# EAGLE design SparkFun_6DoF_LSM6DSO (EAGLE 9.6.2)
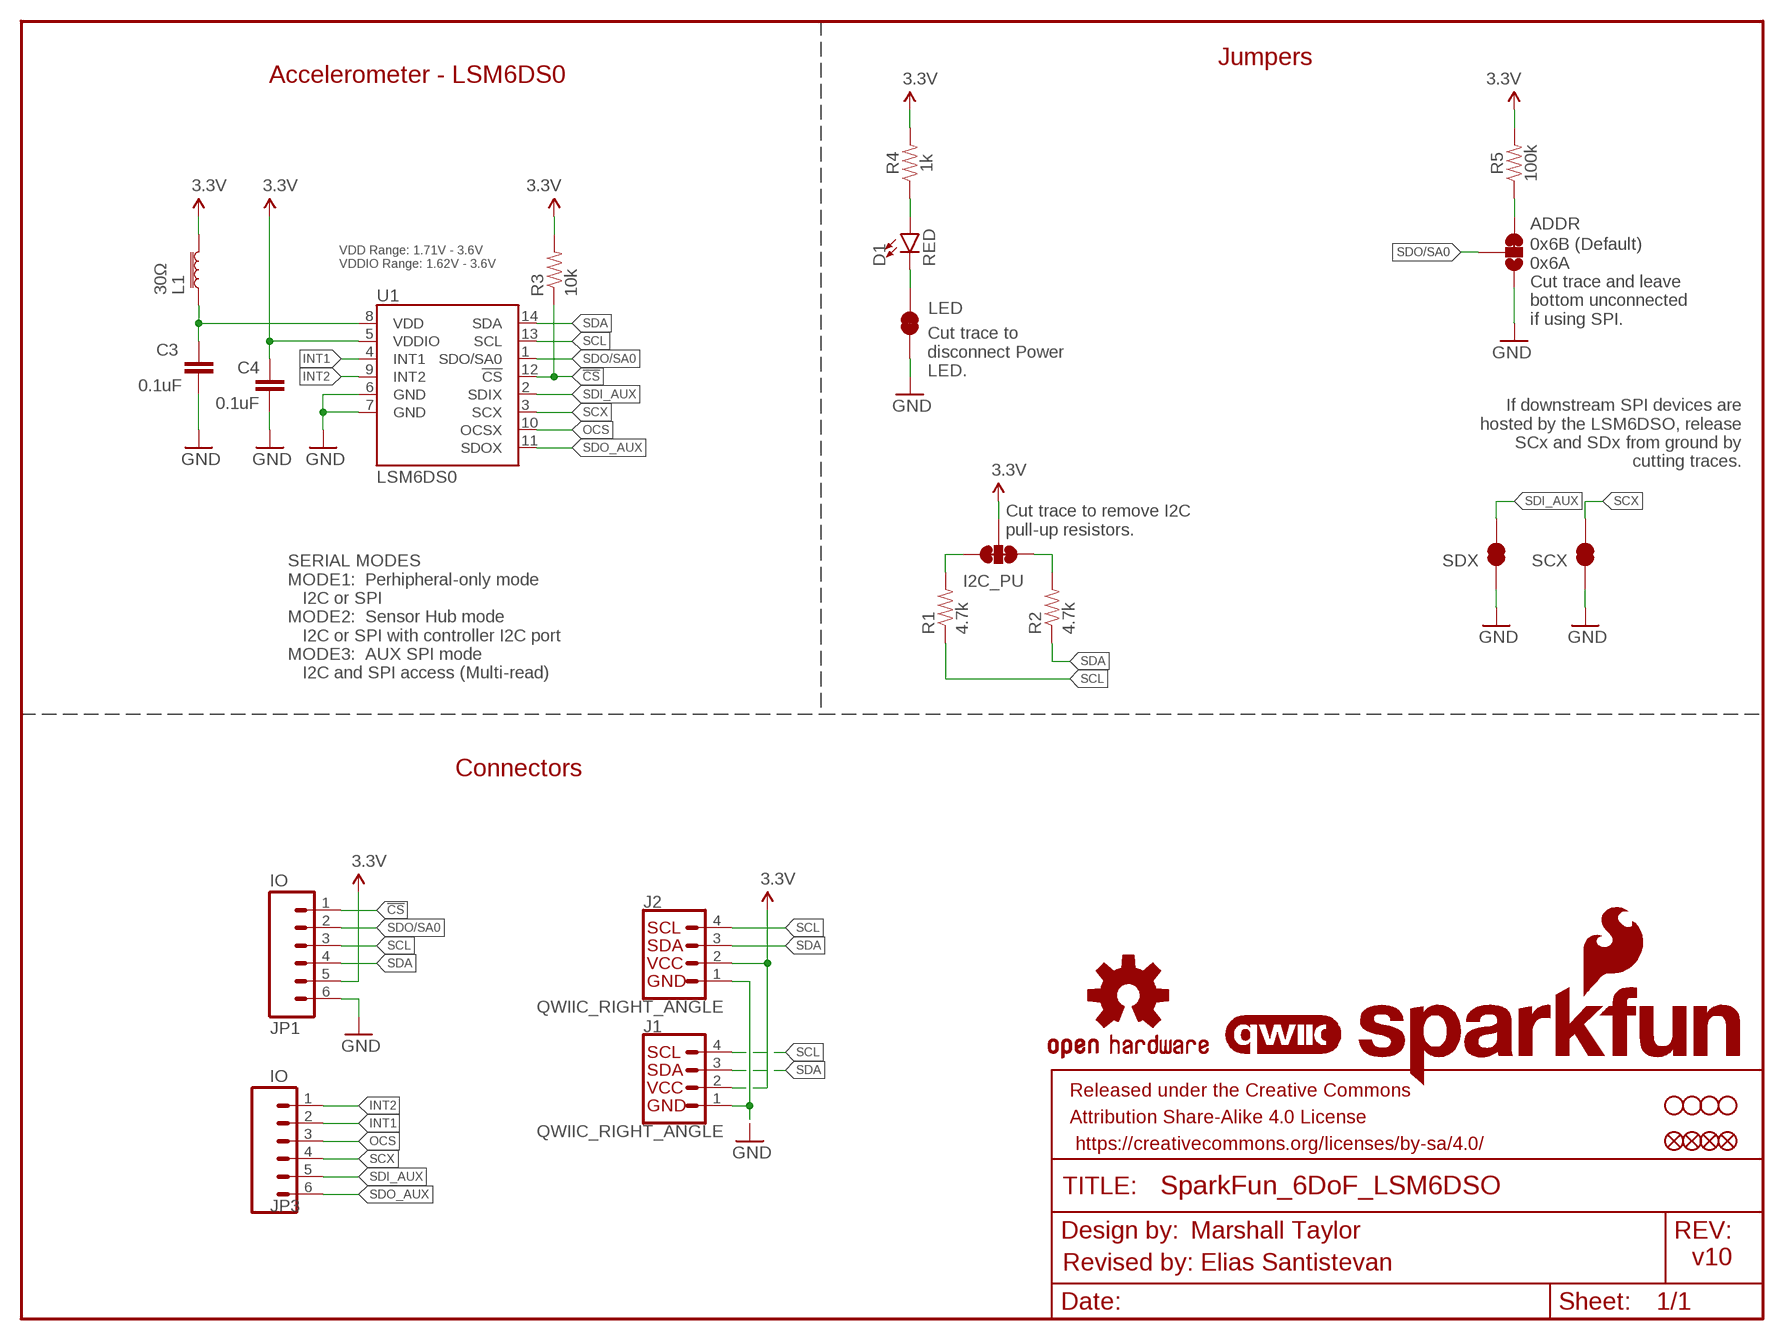
[diagram p0: schematic, sheet 1]

## Parts
ADDR  JUMPER-SMT_3_1-NC_TRACE_SILK  [SMT-JUMPER_3_1-NC_TRACE_SILK]
C3  0.1uF  0.1UF-0603-25V-(+80/-20%)  [0603]
C4  0.1uF  0.1UF-0603-25V-(+80/-20%)  [0603]
D1  RED  LED-RED0603  [LED-0603]
FD1  FIDUCIALUFIDUCIAL  [FIDUCIAL-MICRO]
FD2  FIDUCIALUFIDUCIAL  [FIDUCIAL-MICRO]
FID1  FIDUCIALUFIDUCIAL  [FIDUCIAL-MICRO]
FID2  FIDUCIALUFIDUCIAL  [FIDUCIAL-MICRO]
FRAME1  FRAME-LETTER  [CREATIVE_COMMONS]
I2C_PU  S_MODE  JUMPER-SMT_3_2-NC_TRACE_SILK  [SMT-JUMPER_3_2-NC_TRACE_SILK]
J1  QWIIC_RIGHT_ANGLE  QWIIC_CONNECTORJS-1MM  [JST04_1MM_RA]
J2  QWIIC_RIGHT_ANGLE  QWIIC_CONNECTORJS-1MM  [JST04_1MM_RA]
JP1  IO  CONN_06NO_SILK_NO_POP  [1X06_NO_SILK]
JP3  IO  CONN_06NO_SILK_NO_POP  [1X06_NO_SILK]
L1  30Ω  FERRITE_BEAD-0603-30OHM-100MHZ  [0603]
LED  JUMPER-SMT_2_NC_TRACE_SILK  [SMT-JUMPER_2_NC_TRACE_SILK]
LOGO1  QWIIC_LOGO_4MM  [QWIIC_4MM]
LOGO2  OSHW-LOGOS  [OSHW-LOGO-S]
LOGO3  SFE_LOGO_NAME_FLAME.1_INCH  [SFE_LOGO_NAME_FLAME_.1]
R1  4.7k  4.7KOHM-0603-1/10W-1%  [0603]
R2  4.7k  4.7KOHM-0603-1/10W-1%  [0603]
R3  10k  10KOHM-0603-1/10W-1%  [0603]
R4  1k  1KOHM-0603-1/10W-1%  [0603]
R5  100k  100KOHM-0603-1/10W-1%  [0603]
SCX  JUMPER-SMT_2_NC_TRACE_SILK  [SMT-JUMPER_2_NC_TRACE_SILK]
SDX  JUMPER-SMT_2_NC_TRACE_SILK  [SMT-JUMPER_2_NC_TRACE_SILK]
STANDOFF1  STAND-OFFTIGHT  [STAND-OFF-TIGHT]
STANDOFF2  STAND-OFFTIGHT  [STAND-OFF-TIGHT]
STANDOFF3  STAND-OFFTIGHT  [STAND-OFF-TIGHT]
STANDOFF4  STAND-OFFTIGHT  [STAND-OFF-TIGHT]
U1  LSM6DS0  LSM6DSO  [LGA14L]

## Nets
3.3V: C4.1 I2C_PU.2 J1.2 J2.2 JP1.5 L1.1 R3.2 R4.2 R5.2 U1.5(VDDIO)
!CS!: JP1.1 R3.1 U1.12(!CS!)
GND: ADDR.1 C3.2 C4.2 J1.1 J2.1 JP1.6 LED.1 SCX.1 SDX.1 U1.6(GND) U1.7(GND)
INT1: JP3.2 U1.4(INT1)
INT2: JP3.1 U1.9(INT2)
N$1: ADDR.3 R5.1
N$2: D1.A R4.1
N$3: D1.C LED.2
N$5: I2C_PU.1 R1.2
N$6: I2C_PU.3 R2.2
OCS: JP3.3 U1.10(OCSX)
SCL: J1.4 J2.4 JP1.3 R1.1 U1.13(SCL)
SCX: JP3.4 SCX.2 U1.3(SCX)
SDA: J1.3 J2.3 JP1.4 R2.1 U1.14(SDA)
SDI_AUX: JP3.5 SDX.2 U1.2(SDIX)
SDO/SA0: ADDR.2 JP1.2 U1.1(SDO/SA0)
SDO_AUX: JP3.6 U1.11(SDOX)
VDD: C3.1 L1.2 U1.8(VDD)

## Notes on the sheet
- Jumpers
- Accelerometer - LSM6DS0
- VDD Range: 1.71V - 3.6V
  VDDIO Range: 1.62V - 3.6V
- 0x6B (Default)
  0x6A 
  Cut trace and leave
  bottom unconnected
  if using SPI.
- Cut trace to
  disconnect Power
  LED.
- If downstream SPI devices are
  hosted by the LSM6DSO, release
  SCx and SDx from ground by
  cutting traces.
- Cut trace to remove I2C
  pull-up resistors.
- SERIAL MODES
  MODE1:  Perhipheral-only mode
     I2C or SPI
  MODE2:  Sensor Hub mode
     I2C or SPI with controller I2C port
  MODE3:  AUX SPI mode
     I2C and SPI access (Multi-read)
- Connectors
- Revised by: Elias Santistevan | v10

## Library data of the parts
ADDR = SparkFun-Jumpers:JUMPER-SMT_3_1-NC_TRACE: Normally closed trace jumper (1 of 2 connections) This jumper has a trace between two pads so it's normally closed (NC). The other connection is normally open (NO). Use a razor knife to open the connection. For best results follow the IPC guidelines for cutting traces: Cutout at least 0.063 mm (0.005 in). Remove all loose material to clean up the cut area. Seal the cut with an approved epoxy. Reapply solder to reclose the connection, or to close the NO connection.
C3 C4 = SparkFun-Capacitors:0.1UF: 0.1µF ceramic capacitors A capacitor is a passive two-terminal electrical component used to store electrical energy temporarily in an electric field.; PROD_ID: CAP-00810
D1 = SparkFun-LED:LED-RED: Red SMD LED Used in manufacturing of most products at SparkFun Packages: 0603 - SMD 0603 package [Product Link] <http://docs.avagotech.com/docs/AV02-0551EN> 0603 SMART - SMD 0603 SMART package ( more efficient and expensive)[Product Link] <http://www.osram-os.com/Graphics/XPic2/00077099_0.pdf> 1206 - SMD1206 package [Product Link] <https://www.sparkfun.com/datasheets/DevTools/LilyPad/Q150OVS4.pdff> SparkFun Products: Pro Mini 328 -5V <https://www.sparkfun.com/products/821> RedBoard <https://www.sparkfun.com/products/12757> IOIO-OTG <https://www.sparkfun.com/products/13613>; PROD_ID: DIO-00819
FD1 FD2 FID1 FID2 = SparkFun-Aesthetics:FIDUCIAL: Fiducial Alignment Points Point-of-reference for pick-and-place machines and other optical instruments.
FRAME1 = SparkFun-Aesthetics:FRAME-LETTER: Schematic Frame - Letter Standard 8.5x11 US Letter frame; DESIGNER: Marshall Taylor
I2C_PU = SparkFun-Jumpers:JUMPER-SMT_3_2-NC_TRACE: Normally closed trace jumper (2 of 2 connections) This jumper has a trace between all three pads so they are normally closed (NC). Use a razor knife to open the connection(s). For best results follow the IPC guidelines for cutting traces: Cutout at least 0.063 mm (0.005 in). Remove all loose material to clean up the cut area. Seal the cut with an approved epoxy. Reapply solder to reclose the connection(s).
J1 J2 = SparkFun-Connectors:QWIIC_CONNECTOR: SparkFun I2C Standard Qwiic Connector An SMD 1mm pitch JST connector makes it easy and quick (get it? Qwiic?) to connect I2C devices to each other. The Qwiic system <http://www.sparkfun.com/qwiic> enables fast and solderless connection between popular platforms and various sensors and actuators. We carry 200mm <https://www.sparkfun.com/products/14204>, 100mm <https://www.sparkfun.com/products/14205>, 50mm <https://www.sparkfun.com/products/14206>, and breadboard friendly <https://www.sparkfun.com/products/14207> Qwiic cables. We also offer 10 pcs strips <https://www.sparkfun.com/products/14323> the SMD connectors.; PROD_ID: CONN-13694
JP1 JP3 = SparkFun-Connectors:CONN_06: Multi connection point. Often used as Generic Header-pin footprint for 0.1 inch spaced/style header connections On any of the 0.1 inch spaced packages, you can populate with these: Break Away Headers - Straight <https://www.sparkfun.com/products/116> (PRT-00116) Break Away Male Headers - Right Angle <https://www.sparkfun.com/products/553> (PRT-00553) Female Headers <https://www.sparkfun.com/products/115> (PRT-00115) Break Away Headers - Machine Pin <https://www.sparkfun.com/products/117> (PRT-00117) Break Away Female Headers - Swiss Machine Pin <https://www.sparkfun.com/products/743> (PRT-00743) Arduino Stackable Header - 6 Pin <https://www.sparkfun.com/products/9280> (PRT-09280) For SCREWTERMINALS and SPRING TERMINALS visit here: Screw Terimnals on SparkFun.com <https://www.sparkfun.com/search/results?term=Screw+Terminals> (5mm/3.5mm/2.54mm spacing) This device is also useful as a general connection point to wire up your design to another part of your project. Our various solder wires solder well into these plated through hole pads. Hook-Up Wire - Assortment (Stranded, 22 AWG) <https://www.sparkfun.com/products/11375> (PRT-11375) Hook-Up Wire - Assortment (Solid Core, 22 AWG) <https://www.sparkfun.com/products/11367> (PRT-11367) View the entire wire category on our website here <https://www.sparkfun.com/categories/141>
L1 = SparkFun-Coils:FERRITE_BEAD: Ferrite Bead (blocks, cores, rings, chokes, etc.) Inductor with layers of ferrite used to suppress high frequencies. Often used to isolate high frequency noise. SparkFun Products: IOIO-OTG - V2.2 <https://www.sparkfun.com/products/13613> SparkFun SAMD21 Mini Breakout <https://www.sparkfun.com/products/13664> SparkFun 6 Degrees of Freedom Breakout - LSM6DS3 <https://www.sparkfun.com/products/13339> SparkFun SAMD21 Dev Breakout <https://www.sparkfun.com/products/13672>; PROD_ID: NDUC-07859
LED SCX SDX = SparkFun-Jumpers:JUMPER-SMT_2_NC_TRACE: Normally closed trace jumper This jumper has a trace between two pads so it's normally closed (NC). Use a razor knife to open the connection. For best results follow the IPC guidelines for cutting traces: Cutout at least 0.063 mm (0.005 in). Remove all loose material to clean up the cut area. Seal the cut with an approved epoxy. Reapply solder to reclose the connection.
LOGO1 = SparkFun-Aesthetics:QWIIC_LOGO: Qwiic Logos for placement on schematic and PCB. The 5.5mm silk logo is best for placing next to Qwiic connector.
LOGO2 = SparkFun-Aesthetics:OSHW-LOGO: Open-Source Hardware (OSHW) Logo This logo indicates the piece of hardware it is found on incorporates a OSHW license and/or adheres to the definition of open source hardware found here: http://freedomdefined.org/OSHW
LOGO3 = SparkFun-Aesthetics:SFE_LOGO_NAME_FLAME: SparkFun Font Logo w/ Flame This is the SparkFun full logo. The logo on the schematic will always be the same size; the package variant is the height of the flame part of the logo. Default layer for the logo on the board is tSilk.
R1 R2 = SparkFun-Resistors:4.7KOHM: 4.7kΩ resistor A resistor is a passive two-terminal electrical component that implements electrical resistance as a circuit element. Resistors act to reduce current flow, and, at the same time, act to lower voltage levels within circuits. - Wikipedia; PROD_ID: RES-07857
R3 = SparkFun-Resistors:10KOHM: 10kΩ resistor A resistor is a passive two-terminal electrical component that implements electrical resistance as a circuit element. Resistors act to reduce current flow, and, at the same time, act to lower voltage levels within circuits. - Wikipedia; PROD_ID: RES-00824
R4 = SparkFun-Resistors:1KOHM: 1kΩ resistor A resistor is a passive two-terminal electrical component that implements electrical resistance as a circuit element. Resistors act to reduce current flow, and, at the same time, act to lower voltage levels within circuits. - Wikipedia; PROD_ID: RES-07856
R5 = SparkFun-Resistors:100KOHM: 100kΩ resistor A resistor is a passive two-terminal electrical component that implements electrical resistance as a circuit element. Resistors act to reduce current flow, and, at the same time, act to lower voltage levels within circuits. - Wikipedia; PROD_ID: RES-07828
STANDOFF1-STANDOFF4 = SparkFun-Hardware:STAND-OFF: Stand Off Drill holes for mechanically mounting via screws, standoffs, etc. Note: Use the keepout ring to avoid running the screw head into surrounding components. Variant Overviews STAND-OFF - Mechanical footprint for a #4 phillips button head screw. STAND-OFF-TIGHT - Mechanical footprint for a #4 phillips button head screw, Example SparkFun Products Screw - Phillips Head (1/4", 4-40, 10 pack) <https://www.sparkfun.com/products/10453> (PRT-10453) Screw - Phillips Head (1/2", 4-40, 10 pack) <https://www.sparkfun.com/products/10452> (PRT-10452) Screw - Phillips Head (3/4", 4-40, 10 pack) <https://www.sparkfun.com/products/10451> (PRT-10451) Screw - Phillips Head (1", 4-40, 10 pack) <https://www.sparkfun.com/products/10450> (PRT-10450)
U1 = SparkFun-Sensors:LSM6DSO: The LSM6DSO is a system-in-package featuring a high-performance 3-axis digital accelerometer and 3-axis digital gyroscope.; PROD_ID: IC-15837

## Board
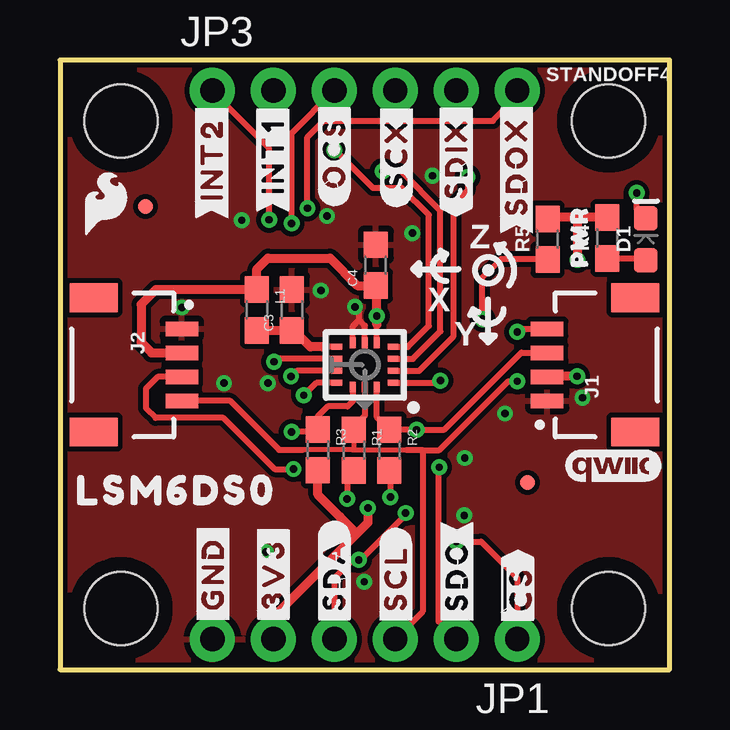
[diagram p1: board, top side]
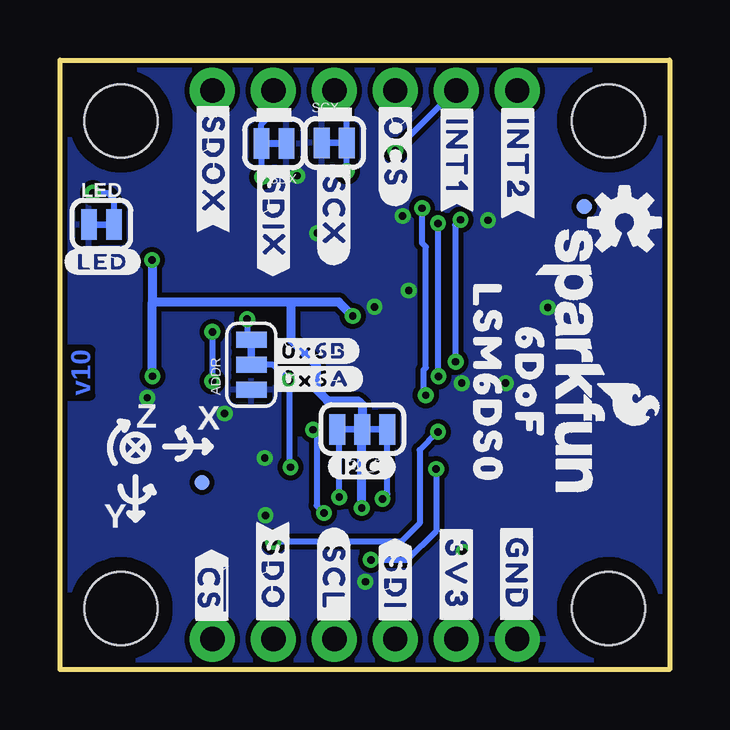
[diagram p2: board, bottom side, seen from below]

Size 25.4 x 25.4 mm. Coordinates in mm from the lower left corner, seen from the top.
Outline: 25.4,25.4 0,25.4 0,0 25.4,0 25.4,25.4
Copper layers (1*16): Top 0.035mm / dielectric 1.5mm / Bottom 0.035mm
Design rules "SparkFun-2-Layer-General-JLCPCB": minimum track width 7mil, minimum drill 0.3mm, track to track 7mil, track to pad 7mil, pad to pad 7mil, via to via 7mil, smd to smd 7mil, copper to edge 7mil, drill to drill 7mil, minimum pad ring 7mil, minimum via ring 7mil, stop-mask expansion 3mil, vias tented up to drill 25mil, thermal gap 10mil

### Footprints (pad centres in the part's own frame; a part is rotated, then mirrored left to right if it is on the bottom)
SMT-JUMPER_3_1-NC_TRACE_SILK = smd 0.66 x 1.27: 1 -1.041,0; 2 0,0; 3 1.041,0
0603 = smd 1.1 x 1: 1 -0.85,0; 2 0.85,0
LED-0603 = smd 1 x 1: A -0.877,0; C 0.877,0
FIDUCIAL-MICRO = smd 0.635 x 0.635: 1 0,0
SMT-JUMPER_3_2-NC_TRACE_SILK = smd 0.66 x 1.27: 1 -1.041,0; 2 0,0; 3 1.041,0
JST04_1MM_RA = smd 0.6 x 1.35: 1 -1.5,0; 2 -0.5,0; 3 0.5,0; 4 1.5,0 | smd 1.2 x 2: NC1 2.8,-3.675; NC2 -2.8,-3.675
1X06_NO_SILK = drill 1.016 pad 1.88: 1 0,0; 2 2.54,0; 3 5.08,0; 4 7.62,0; 5 10.16,0; 6 12.7,0
SMT-JUMPER_2_NC_TRACE_SILK = smd 0.66 x 1.27: 1 -0.521,0; 2 0.521,0
STAND-OFF-TIGHT = hole 3.048: 0,0
LGA14L = smd 0.45 x 0.25: 1 -1.175,0.75; 2 -1.175,0.25; 3 -1.175,-0.25; 4 -1.175,-0.75; 8 1.175,-0.75; 9 1.175,-0.25; 10 1.175,0.25; 11 1.175,0.75 | smd 0.25 x 0.45: 5 -0.5,-0.925; 6 0,-0.925; 7 0.5,-0.925; 12 0.5,0.925; 13 0,0.925; 14 -0.5,0.925

### Placement (x,y rotation side)
ADDR  17.43,12.7 90 bottom
C3  9.66,14.99 90 top
C4  13.16,16.85 90 top
D1  24.41,17.93 90 top
FD1  3.56,19.3 0 bottom
FD2  19.48,7.8 0 bottom
FID1  3.56,19.3 0 top
FID2  19.48,7.8 0 top
FRAME1  -19.05,-11.43 0 top  (outside the outline)
I2C_PU  12.8,10.01 180 bottom
J1  20.29,12.7 90 top
J2  5.08,12.7 270 top
JP1  19.05,1.27 180 top
JP3  6.35,24.13 0 top
L1  8.2,14.99 270 top
LED  23.67,18.54 0 bottom
LOGO1  23.06,8.48 0 top
LOGO2  1.88,18.62 0 bottom
LOGO3  4.12,12.79 270 bottom
R1  12.24,9.14 270 top
R2  13.72,9.14 270 top
R3  10.74,9.16 270 top
R4  22.81,17.98 90 top
R5  20.32,17.93 90 top
SCX  13.97,21.95 0 bottom
SDX  16.48,21.92 180 bottom
STANDOFF1  2.54,22.86 0 top
STANDOFF2  2.54,2.54 0 top
STANDOFF3  22.86,2.54 0 top
STANDOFF4  22.86,22.86 0 top
U1  12.7,12.7 180 top
U$1  [#3V3#1]  8.89,3.96 90 top
U$2  [#GND#0]  6.38,3.99 90 top
U$3  [##CS##7]  19.08,3.35 90 top
U$4  [#SDA#4]  11.43,3.96 90 top
U$5  [#SCL#5]  14,3.81 90 top
U$6  [#SDO#6]  16.54,3.94 90 top
U$7  [#INT1#9]  8.86,21.39 90 top
U$8  [#INT2#9]  6.32,21.26 90 top
U$9  [#OCS#8]  11.43,21.54 90 top
U$10  [#SCX#9]  14.02,21.49 90 top
U$11  [#SDIX#11]  16.51,21.31 90 top
U$12  [LSM6DS011]  7.59,11.91 270 bottom
U$13  [#0X6A#11]  14.73,12.12 0 bottom
U$14  [#0X6B#11]  14.81,13.28 0 bottom
U$15  [#3V3#1]  8.89,3.96 270 bottom
U$16  [#LED#11]  23.62,16.99 0 bottom
U$17  [#GND#0]  6.38,3.99 270 bottom
U$18  [#SDO#7]  16.54,3.94 270 bottom
U$19  [#INT1#9]  8.86,21.39 270 bottom
U$20  [#OCS#7]  11.43,21.54 270 bottom
U$21  [#INT2#9]  6.32,21.26 270 bottom
U$22  [#SCL#5]  14,3.81 270 bottom
U$23  [#SCX#8]  14,19.08 270 bottom
U$24  [#SDOX#12]  19.02,20.98 90 top
U$25  [#I2C#11]  12.83,8.46 0 bottom
U$26  [#SDI#4]  11.43,3.61 270 bottom
U$27  [##CS##8]  19.08,3.35 270 bottom
U$28  [PWR8]  21.64,18.03 90 top
U$29  [SFE_LOGO_FLAME_.1]  1.91,19.43 0 top
U$30  [LSM6DS011]  4.85,7.47 0 top
U$31  [6DOF12]  5.84,11.94 270 bottom
U$32  [#SDOX#12]  19.02,21.01 270 bottom
U$33  [#SDIX#11]  16.51,18.82 270 bottom

### Tracks (layer width: path | path; a pad name or v marks a point on that pad's centre or on a via)
3.3V  (via drill 0.3)
  Top 0.254: U1.5 13.2,14.38
  Top 0.381: J1.2 20.32,12.22 v21.55,12.22 | J2.2 3.82,13.2 3.38,13.64 3.38,15.21 4,15.84 L1.1 8.2,16.69 8.66,17.14 11.25,17.14 12.39,16 C4.1 13.2,15.96 v13.2,14.73 13.2,14.38 | JP1.5 8.89,2.18 12.37,5.66 | v12.83,6.73 12.83,6.12 12.37,5.66 | R4.2 22.8,18.85 21.59,18.85 | 12.37,5.66 11.66,6.38 10.74,7.29 R3.2 | R5.2 20.38,18.85 21.59,18.85 | v21.57,17.07 21.57,18.82 21.59,18.85
  Bottom 0.381: v12.83,6.73 12.83,9.99 I2C_PU.2 12.8,11.02 12.98,11.2 14.25,11.2 14.73,11.68 14.73,12.7 15.77,13.74 15.77,15.29 15.75,15.32 | v21.55,12.22 21.55,15.32 | v13.2,14.73 13.78,15.32 15.75,15.32 | 15.75,15.32 21.55,15.32 | 21.55,15.32 21.55,17.05 v21.57,17.07
!CS!  (via drill 0.3)
  Top 0.254: U1.12 12.2,11.18 11.99,10.97 11.15,10.97 10.74,10.57 R3.1 10.64,9.91 v9.65,9.91 | v16.51,5.33 17.55,5.33 19.05,3.83 JP1.1
  Bottom 0.254: v16.51,5.33 11.18,5.33 10.41,6.1 10.41,9.14 v9.65,9.91
GND  (via drill 0.3)
  Top 0.254: U1.6 12.7,14.33 12.46,14.57 | U1.7 12.2,14.31 12.46,14.57 | 12.46,14.57 12.46,14.94 v12.29,15.11
  other vias: 10.87,15.8 15.52,20.57 18.54,10.67 8.59,4.9 7.57,18.72 8.66,11.94 5.08,15.09 14.68,18.19 11.13,18.9 21.77,11.33 6.83,11.94 12.67,3.66 16.84,6.43 16.87,8.81
  pour Bottom (isolate 0.203): 25.4,0 25.4,25.4 0,25.4 0,0
  pour Top (isolate 0.203, rank 2): 25.4,0 25.4,25.4 0,25.4 0,0
INT1  (via drill 0.3)
  Top 0.254: U1.4 14.49,13.45 15.37,14.33 15.37,18.95 14.25,20.07 13.04,20.07 11.47,21.64 v11.43,21.64
  Bottom 0.254: v11.43,21.64 8.94,24.13 JP3.2
INT2  (via drill 0.3)
  Top 0.254: JP3.1 6.3,24.13 8.71,21.72 v8.71,18.75 | v8.91,12.83 9.04,12.95 U1.9
  Bottom 0.254: v8.71,18.75 8.94,18.52 8.94,12.85 v8.91,12.83
N$1  (via drill 0.3)
  Top 0.254: v17.6,14.61 17.6,16.33 18.38,17.11 20.3,17.11 R5.1
  Bottom 0.254: v17.6,14.61 17.6,13.91 ADDR.3
N$2
  Top 0.254: R4.1 24.33,17.13 D1.A
N$3  (via drill 0.3)
  Top 0.254: D1.C 24.03,19.19 v24.03,19.86
  Bottom 0.254: v24.03,19.86 23.42,19.86 23.15,19.6 LED.2
N$5  (via drill 0.3)
  Top 0.254: R1.2 11.96,8.02 v11.96,7.11
  Bottom 0.254: v11.96,7.11 11.76,7.32 I2C_PU.1
N$6  (via drill 0.3)
  Top 0.254: R2.2 13.77,8.25 v13.77,7.19
  Bottom 0.254: v13.77,7.19 13.77,9.94 I2C_PU.3
OCS  (via drill 0.3)
  Top 0.254: v9.63,12.22 9.86,12.45 U1.10 | JP3.3 9.65,22.35 v9.65,18.59
  Bottom 0.254: v9.65,18.59 9.65,12.24 v9.63,12.22
SCL  (via drill 0.3)
  Top 0.203: 14.43,9.14 12.95,9.14 12.94,9.16 12.19,9.16 | R1.1 12.24,9.2 12.19,9.16 | 12.19,9.16 10.11,9.16
  Top 0.254: 15.11,9.14 14.43,9.14 | 15.11,9.14 15.8,9.14 18.67,12.01 v19.05,12.01 | v19.05,14.07 19.18,14.2 J1.4 | 15.11,9.14 15.11,2.41 JP1.3 | J2.4 7.09,11.2 9.13,9.16 10.11,9.16 | U1.13 12.7,10.59 12.24,10.12 R1.1
  Bottom 0.254: v19.05,14.07 v19.05,12.01
SCX  (via drill 0.3)
  Top 0.254: v13.45,20.77 14.21,20.77 15.85,19.13 15.85,14.1 14.7,12.95 U1.3
  Bottom 0.254: v13.45,20.77 SCX.2 13.45,23.61 JP3.4
SDA  (via drill 0.3)
  Top 0.254: J1.3 19.23,13.21 16.01,9.99 v14.86,9.99 R2.1 13.2,10.52 U1.14 | v14.4,6.53 14.39,6.51 14.39,6.44 12.52,4.57 v12.45,4.57 12.19,4.57 11.43,3.81 JP1.4 | J2.3 4.06,12.19 3.58,11.71 3.58,10.9 3.99,10.49 6.81,10.49 8.94,8.36 v9.73,8.36
  Bottom 0.254: v14.86,9.99 14.71,9.84 14.71,6.83 v14.4,6.53 | v12.45,4.57 10.92,4.57 9.73,5.77 v9.73,8.36
SDI_AUX  (via drill 0.3)
  Top 0.254: v16.98,20.52 16.98,19.96 16.38,19.37 16.38,13.87 14.96,12.45 U1.2
  Bottom 0.254: v16.98,20.52 17,20.55 SDX.2 17,22.73 16.51,23.23 JP3.5
SDO/SA0  (via drill 0.3)
  Top 0.254: v15.85,12.04 15.76,11.95 U1.1 | JP1.2 15.77,2.01 15.77,8.41 v15.8,8.43
  Bottom 0.254: ADDR.2 16.51,12.7 v15.85,12.04 15.85,8.48 v15.8,8.43
SDO_AUX  (via drill 0.3)
  Top 0.254: U1.11 10.68,11.95 v10.16,11.43 | v10.31,19.22 10.31,22.18 10.99,22.86 18.03,22.86 19.05,23.88 JP3.6
  Bottom 0.254: v10.16,11.43 10.26,11.53 10.26,12.48 10.16,12.58 10.16,17.62 10.31,17.77 v10.31,19.22
VDD
  Top 0.254: 9.59,14.21 C3.1 | U1.8 10.95,13.45
  Top 0.381: L1.2 C3.1 | 9.59,14.21 9.67,14.21 10.43,13.45 10.95,13.45

### Text on the board
Bottom: v10
tPlace: Z | X | Y
bPlace: X | Z | Y
tDocu: Revised By: Elias Santistevan